# Altium schematic sheet IO_Expandor.SchDoc: IO_Expandor
size A3; DocumentNumber: MB1144; Revision: C-02; SheetNumber: 6; SheetTotal: 25; Project: STM32L476G-EVAL; ModifiedDate: 9/23/2015
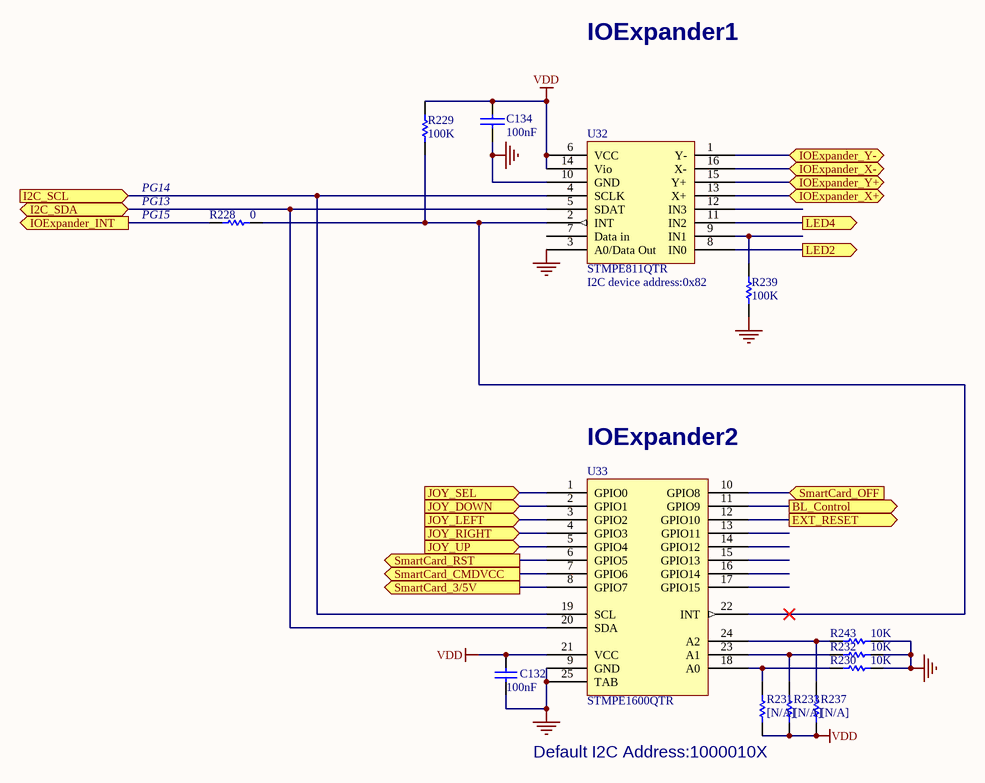
[diagram p0: IO_Expandor.SchDoc]

## Parts
C132  100nF  [0402C]
C134  100nF  [0402C]
R228  0  [0603R]
R229  100K  [0402R]
R230  10K  [0402R]
R231  [N/A]  [0603R]
R232  10K  [0402R]
R233  [N/A]  [0603R]
R237  [N/A]  [0603R]
R239  100K  [0402R]
R243  10K  [0402R]
U32  STMPE811QTR  [QFN16_0R5_3X3]
U33  STMPE1600QTR  [QFN24_0R5_4X4]

## Ports
BL_Control (out), EXT_RESET (out), I2C_SCL (in), I2C_SDA (bidir), IOExpander_INT (out), IOExpander_X+ (bidir), IOExpander_X- (bidir), IOExpander_Y+ (bidir), IOExpander_Y- (bidir), JOY_DOWN (in), JOY_LEFT (in), JOY_RIGHT (in), JOY_SEL (in), JOY_UP (in), LED2 (out), LED4 (out), SmartCard_3/5V (out), SmartCard_CMDVCC (out), SmartCard_OFF (in), SmartCard_RST (out)

## Nets
GND: C132.2 C134.2 R230.1 R232.1 R239.2 R243.1 U32.3(A0/Data_Out) U32.10(GND) U33.9(GND) U33.25(TAB)
VDD: C132.1 C134.1 R229.1 R231.1 R233.1 R237.1 U32.6(VCC) U32.14(Vio) U33.21(VCC)
BL_Control: U33.11(GPIO9) ; port BL_Control
EXT_RESET: U33.12(GPIO10) ; port EXT_RESET
I2C_SCL: U32.4(SCLK) U33.19(SCL) ; port I2C_SCL
I2C_SDA: U32.5(SDAT) U33.20(SDA) ; port I2C_SDA
IOExpander_INT: R228.1 ; port IOExpander_INT
IOExpander_X+: U32.13(X+) ; port IOExpander_X+
IOExpander_X-: U32.16(X-) ; port IOExpander_X-
IOExpander_Y+: U32.15(Y+) ; port IOExpander_Y+
IOExpander_Y-: U32.1(Y-) ; port IOExpander_Y-
JOY_DOWN: U33.2(GPIO1) ; port JOY_DOWN
JOY_LEFT: U33.3(GPIO2) ; port JOY_LEFT
JOY_RIGHT: U33.4(GPIO3) ; port JOY_RIGHT
JOY_SEL: U33.1(GPIO0) ; port JOY_SEL
JOY_UP: U33.5(GPIO4) ; port JOY_UP
LED2: U32.8(IN0) ; port LED2
LED4: U32.11(IN2) ; port LED4
SmartCard_3/5V: U33.8(GPIO7) ; port SmartCard_3/5V
SmartCard_CMDVCC: U33.7(GPIO6) ; port SmartCard_CMDVCC
SmartCard_OFF: U33.10(GPIO8) ; port SmartCard_OFF
SmartCard_RST: U33.6(GPIO5) ; port SmartCard_RST
NetR228_2: R228.2 R229.2 U32.2(INT) U33.22(INT)
NetR230_2: R230.2 R231.2 U33.18(A0)
NetR232_2: R232.2 R233.2 U33.23(A1)
NetR237_2: R237.2 R243.2 U33.24(A2)
NetR239_1: R239.1 U32.9(IN1)

Not connected (* = marked no-connect by the designer): U32 7(Data_in) 12(IN3); U33 13(GPIO11) 14(GPIO12) 15(GPIO13) 16(GPIO14) 17(GPIO15)

## Notes on the sheet
- IOExpander1
- PG13
- PG14
- PG15
- I2C device address:0x82
- (near U33) IOExpander2
- Default I2C Address:1000010X
- Title:
- Project:
- Size:
- Date:
- A3
- Reference:
- Sheet:
- Revision:
- of

## Library data of the parts
C132 = Cap: Capacitor; Value: 10nF; Ordered by: Subcon; ECCN_US/EU: NA; Published: 8-Jun-2000; Revision: July-2002: Re-released for DXP Platform.; Publisher: Altium Limited
C134 = CAP: Capacitor; Ordered by: Subcon; ECCN_US/EU: NA
R228 R229 R239 = Res1: Resistor; Value: 1K; Ordered by: Subcon; ECCN_US/EU: NA; Published: 8-Jun-2000; Revision: July-2002: Re-released for DXP Platform.; Publisher: Altium Limited
R230 R232 R243 = res1: Resistor; Value: 1K; Ordered by: Subcon; ECCN_US/EU: NA; Published: 8-Jun-2000; Revision: July-2002: Re-released for DXP Platform.; Publisher: Altium Limited
R231 R233 R237 = Res1: Resistor; Value: 1K; Ordered by: Subcon; ECCN_US/EU: NA; Fitted: NO; Published: 8-Jun-2000; Revision: July-2002: Re-released for DXP Platform.; Publisher: Altium Limited
U32 = STMPE811: Ordered by: ST; ECCN_US/EU: EAR99/NEC; Ref St: 9177945; Manuf_1: ST; Manuf_Part_1: STMPE811QTR
U33 = STMPE1600: Ordered by: ST; ECCN_US/EU: EAR99/NEC; Ref St: 9177976; Manuf_1: ST; Manuf_Part_1: STMPE1600QTR